# EasyEDA Pro project LEAP_CAM.epro

# Schematic LEAP_CAM

## Sheets
1 MAIN: Create Date: 2023-11-26; Page Name: MAIN; Project Name: AiPi-Cam-D200; Schematic Name: _AiPi-Cam-D200; Update Date: 2023-11-26; Company: 嘉立创EDA; Page Size: A4; Version: V1.0
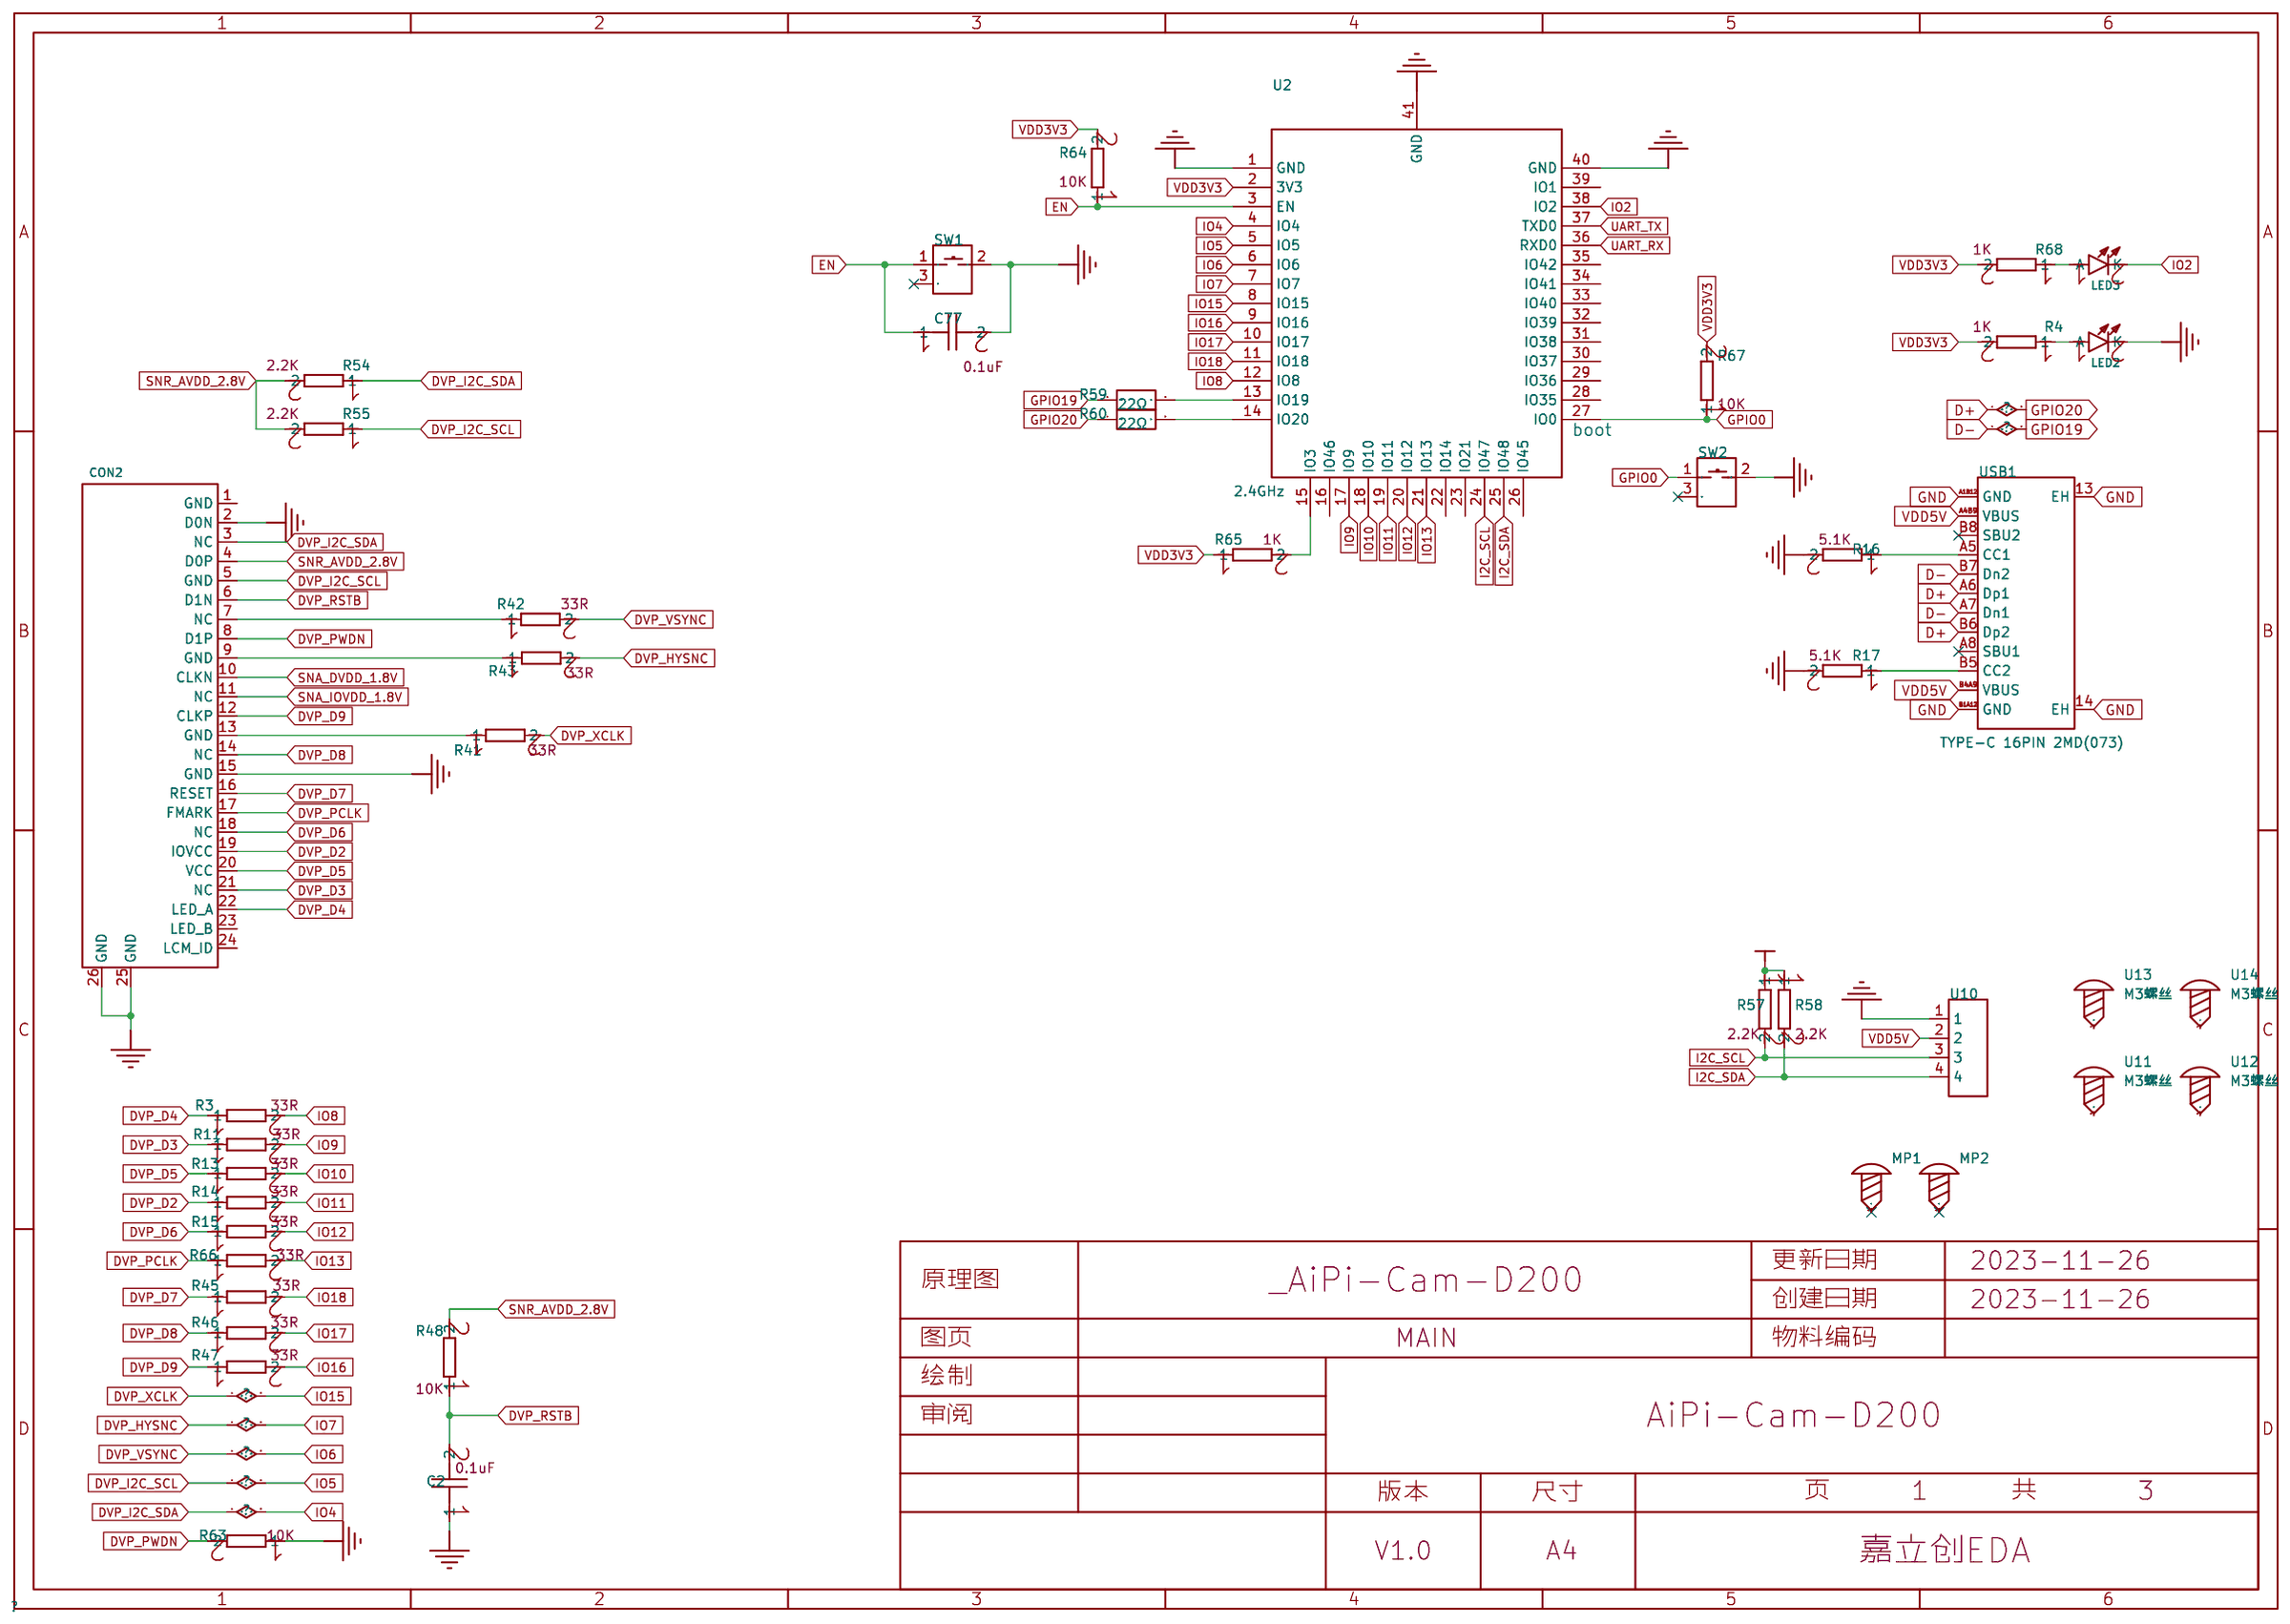
[diagram p0: MAIN]
2 POWER: Page Name: POWER
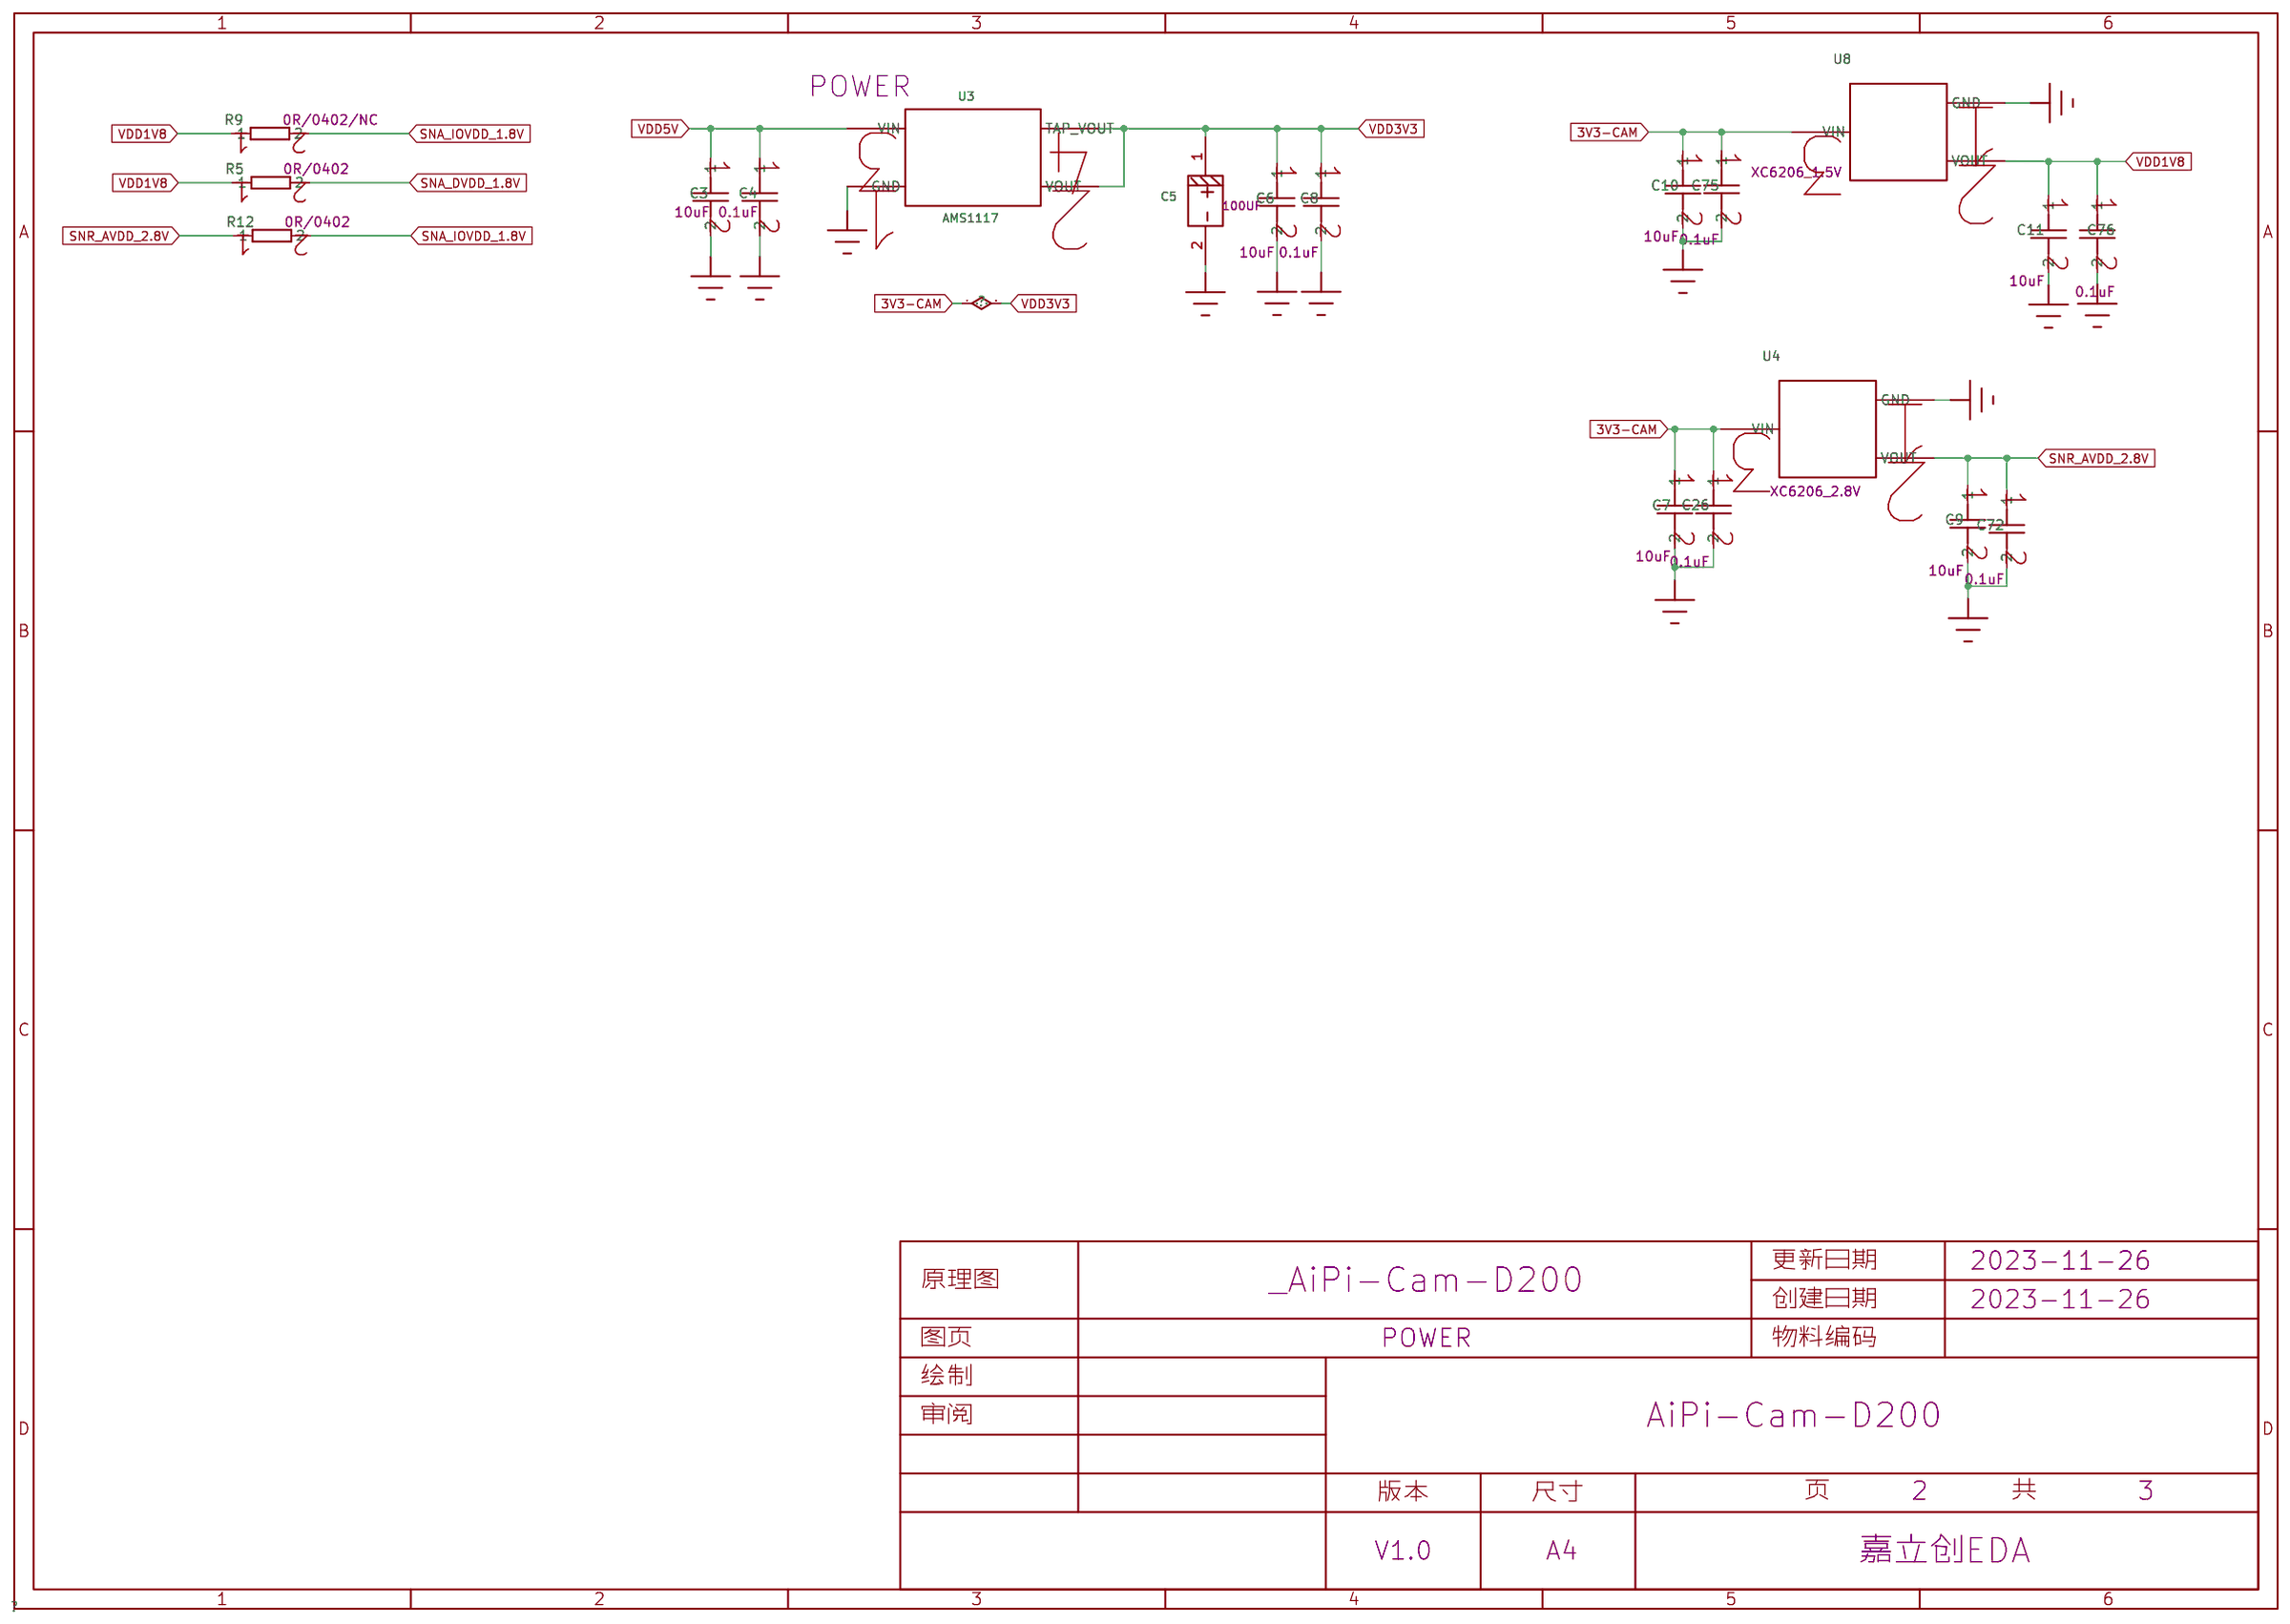
[diagram p1: POWER]
3 TF-CARD: Page Name: TF-CARD; Update Date: 2023-11-27
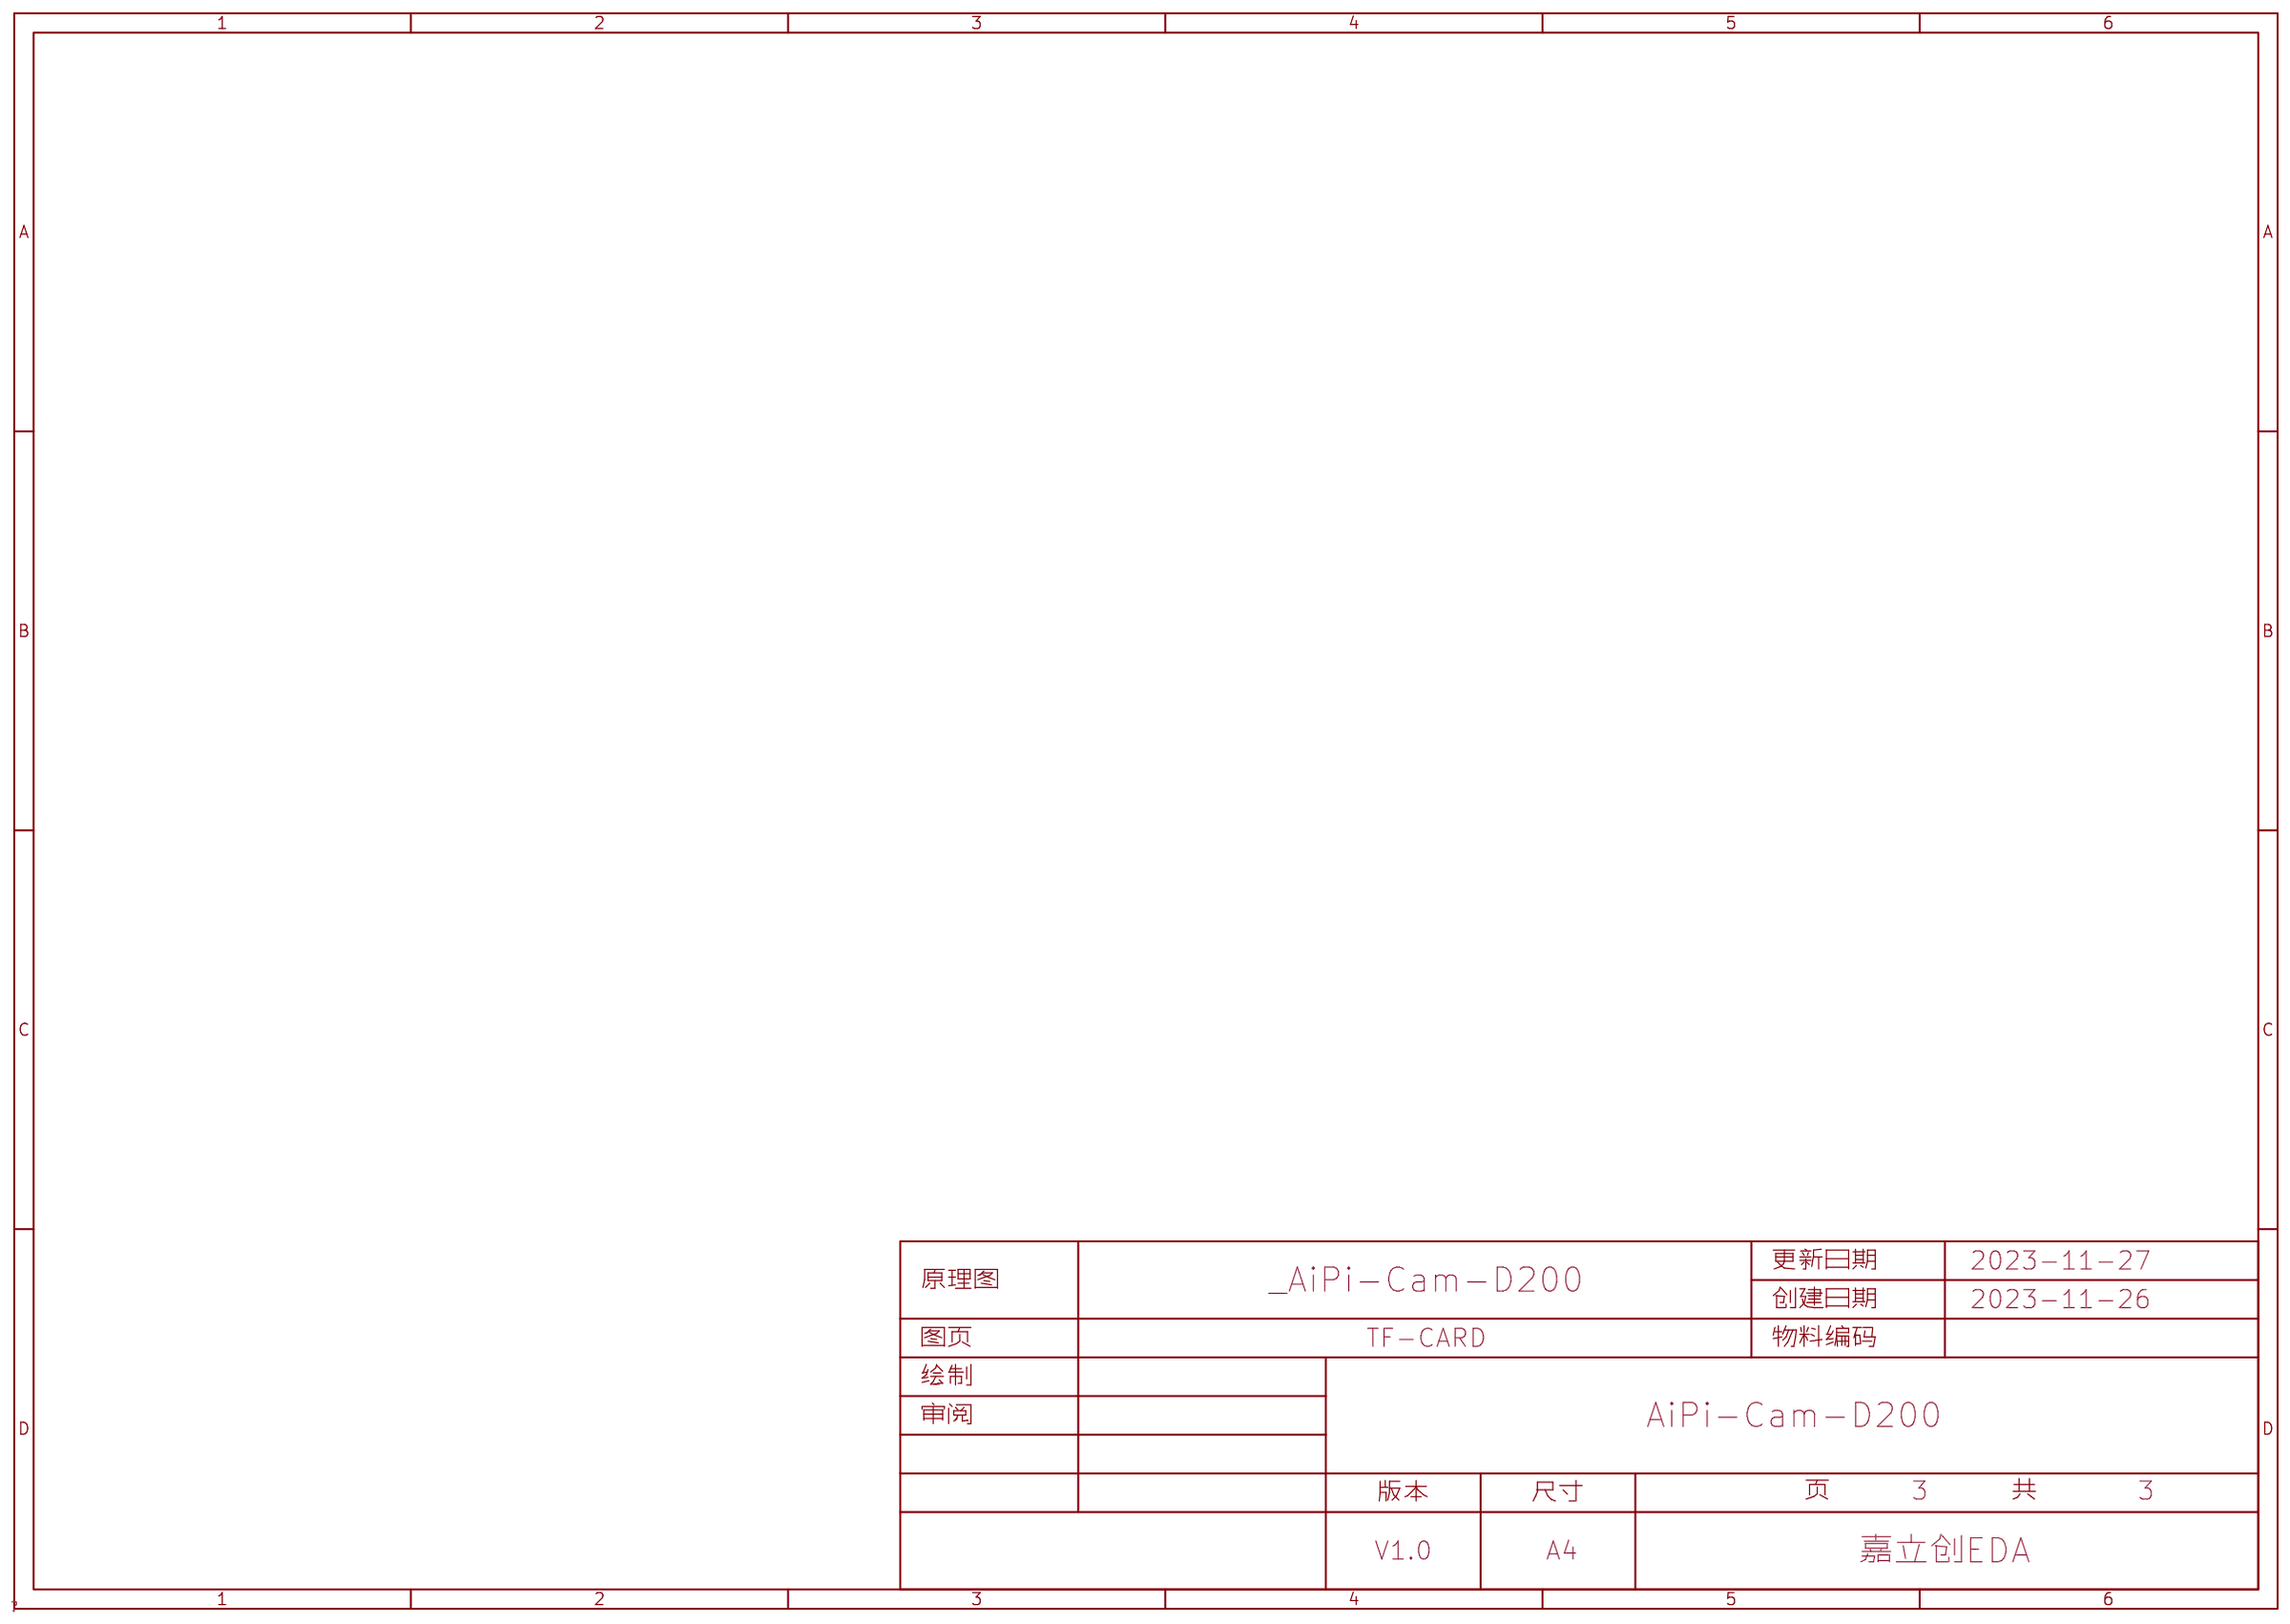
[diagram p2: TF-CARD]

## Parts
sheet MAIN
C2  CAP_NP  [C0402]
C77  CAP_NP  [C0402]
CON2  ST7701S  [FPC24PIN-0.5-PCB]
LED2  LED-SMD  [SMT_LED_0603]
LED3  LED-SMD  [SMT_LED_0603]
MP1  M2螺丝  [M2螺丝]
MP2  M2螺丝  [M2螺丝]
R3  33R  [R0402]
R4  1K  [R0402]
R11  33R  [R0402]
R13  33R  [R0402]
R14  33R  [R0402]
R15  33R  [R0402]
R16  5.1K  [R0402]
R17  5.1K  [R0402]
R41  R0402  [R0402]
R42  R0402  [R0402]
R43  R0402  [R0402]
R45  33R  [R0402]
R46  33R  [R0402]
R47  33R  [R0402]
R48  R0402  [R0402]
R54  2.2K  [R0402]
R55  2.2K  [R0402]
R57  2.2K  [R0402]
R58  2.2K  [R0402]
R59  22Ω  [R0402]
R60  22Ω  [R0402]
R63  10K  [R0402]
R64  R0402  [R0402]
R65  1K  [R0402]
R66  33R  [R0402]
R67  R0402  [R0402]
R68  1K  [R0402]
SW1  K2-1109DE-G4SW-04  [KEY-TH_3P-L4.5-W6.5-P3.00]
SW2  K2-1109DE-G4SW-04  [KEY-TH_3P-L4.5-W6.5-P3.00]
U2  2.4GHz  [WIRELM-SMD_ESP32-S3-WROOM-1U]
U10  WAFER-PH2.0-4PWZ  [CONN-TH_4P-P2.00_BX-PH2.0-4PWZ]
U11  M3螺丝  [M3螺丝孔]
U12  M3螺丝  [M3螺丝孔]
U13  M3螺丝  [M3螺丝孔]
U14  M3螺丝  [M3螺丝孔]
USB1  TYPE-C 16PIN 2MD(073)  [USB-C-SMD_TYPE-C-16PIN-2MD-073]
sheet POWER
C3  CAP_NP  [C0603]
C4  CAP_NP  [C0402]
C5  CAP-DAN-PART  [CAP-DAN-B3528-PCB]
C6  CAP_NP  [C0402]
C7  CAP_NP  [C0402]
C8  CAP_NP  [C0402]
C9  CAP_NP  [C0402]
C10  CAP_NP  [C0402]
C11  CAP_NP  [C0402]
C26  CAP_NP  [C0402]
C72  CAP_NP  [C0402]
C75  CAP_NP  [C0402]
C76  CAP_NP  [C0402]
R5  R0402  [R0402]
R9  R0402  [R0402]
R12  R0402  [R0402]
U3  AMS1117  [SOT-223]
U4  AF6206N_SOT23_PART  [SOT23-PCB]
U8  AF6206N_SOT23_PART  [SOT23-PCB]

## Library data of the parts
C2 C4 C8 C26 C72 C75 C77 = CAP_NP: Surface mount capacitor 0805; Comment: 0.1uF
CON2 = ST7701S
LED2 LED3 = LED-SMD: --ƬLED; BOMNRXQ: --ƬLED; BLZUHUEY: www.ooocke.com; UWSMDZUK: Դ----; Comment: W
MP1 MP2 = 螺丝孔
R3 R4 R11 R13-R17 R45-R47 R54 R55 R57 R58 R63 R65 R66 R68 = R0402: Surface mount resistor 0402
R41-R43 = R0402: Surface mount resistor 0402; Comment: 33R
R48 R64 R67 = R0402: Surface mount resistor 0402; Comment: 10K
R59 R60 = FRC0402F22R0TS: 电阻类型:厚膜电阻;阻值:22Ω;精度:±1%;功率:62.5mW;工作电压:50V;温度系数:±100ppm/℃;; LCSC Part Name: 22Ω ±1% 62.5mW 厚膜电阻; Supplier Part: C2929994; Manufacturer: FOJAN(富捷); Supplier Footprint: 0402; JLCPCB Part Class: Extended Part; Datasheet: https://item.szlcsc.com/datasheet/FRC0402F22R0TS/3266927.html; Supplier: LCSC; Type: 厚膜电阻; Tolerance: ±1%; Power(Watts): 62.5mW; Voltage-Supply(Max): 50V; Temperature Coefficient: ±100ppm/℃; Operating Temperature: -55℃~+155℃
SW1 SW2 = K2-1109DE-G4SW-04: 作用力:250gf;安装方式:卧插;开关长度:4.5mm;开关宽度:4.5mm;开关高度:6.5mm;触点电流:50mA;额定电压(DC):12V;绝缘电阻:100MΩ;机械寿命:10万次;; LCSC Part Name: 4.5*4.5*6.5 三脚侧插开关; Supplier Part: C2686326; Manufacturer: 韩国韩荣; Supplier Footprint: 插件; JLCPCB Part Class: Extended Part; Datasheet: https://atta.szlcsc.com/upload/public/pdf/source/20210810/329661682BA8B3C2B40574DEC7B97564.pdf; Supplier: LCSC; Operating Force: 250gf; Mounting Style: 卧插; Switch Length: 4.5mm; Switch Width: 4.5mm; Switch Height: 6.5mm; Contact Current: 50mA; Voltage Rating (DC): 12V; Insulation Resistance: 100MΩ; Mechanical Life: 10万次; Operating Temperature: -25℃~+85℃
U2 = ESP32-S3-WROOM-1U-N4: 核心芯片:ESP32-S3;频率:2.4GHz;发射功率:20.5dBm;接收灵敏度:-103.5dBm;; LCSC Part Name: 不带固件 通用型Wi-Fi+低功耗蓝牙MCU模组; Supplier Part: C2980296; Manufacturer: ESPRESSIF(乐鑫); Supplier Footprint: SMD,19.2x18mm; JLCPCB Part Class: Extended Part; Datasheet: https://item.szlcsc.com/datasheet/ESP32-S3-WROOM-1U-N4/3401548.html; Supplier: LCSC; Utilized IC / Part: ESP32-S3; Wireless Standard: Bluetooth5.0; Interface Type: I2C；UART；SPI；USB；I2S; Output Power: 20.5dBm; Voltage - Supply: 3V~3.6V; Receive  Current: 95mA; Send  Current: 355mA; Sensitivity: -103.5dBm; Operating Temperature: -40℃~+85℃
U10 = WAFER-PH2.0-4PWZ: 插针结构:1x4P;间距:2mm;安装方式:弯插;参考系列:PH;总PIN数:4P;排数:1;每排PIN数:4;行距:-;额定电流:2A;触头材质:黄铜;触头镀层:锡;工作温度:-25℃~+85℃;; LCSC Part Name: 1x4P 间距:2mm 弯插 系列:PH; Supplier Part: C5359612; Manufacturer: XUNPU(讯普); Supplier Footprint: 弯插,P=2mm; JLCPCB Part Class: Extended Part; Datasheet: https://item.szlcsc.com/datasheet/WAFER-PH2.0-4PWZ/6173848.html; Supplier: LCSC; Pins Structure: 1x4P; Pitch: 2mm; Mounting Type: 弯插; Reference Series: PH; Number of Pins: 4P; Number of Rows: 1; Number of PINs Per Row: 4; Current Rating: 2A; Contact Material: 黄铜; Contact Plating: 锡; Operating Temperature: -25℃~+85℃; Voltage Rating: 250V; Plastic Material: PA66; Flame Retardant Rating: UL94V-0; Color: 白色; Z-Height of the Board: 4.7mm; X-Length of Bottom Edge on Board (Spacing Line): 10mm; Y-Width of Bottom Edge on Board: 6.05mm
U11-U14 = M3螺丝
USB1 = TYPE-C 16PIN 2MD(073): 连接器类型:Type-C;协议标准:-;公母:母;安装方式:卧贴;触点数量:16P;端口数量:1;额定电流 - 电源:3A;工作温度:-25℃~+85℃;; LCSC Part Name: Type-C 母 卧贴; Supplier Part: C2765186; Manufacturer: SHOU HAN(首韩); Supplier Footprint: SMD; JLCPCB Part Class: Extended Part; Datasheet: https://item.szlcsc.com/datasheet/TYPE-C%252016PIN%25202MD(073)/2901843.html; Supplier: LCSC; Connector Type: Type-C; Gender: 母; Mounting Type: 卧贴; Number of Contacts: 16P; Number of Ports: 1; Current Rating-Power: 3A; Voltage Rating: 5V; Connect-Disconnect Life: 1万次; Detection color: 黑色; Operating Temperature: -25℃~+85℃
C3 C6 C7 C9-C11 = CAP_NP: Surface mount capacitor 0805; Comment: 10uF
C5 = CAP-DAN-PART: Vaule: 100UF
C76 = CAP_NP: Surface mount capacitor 0402; Comment: 0.1uF
R5 R12 = R0402: Surface mount resistor 0402; Comment: 0R/0402
R9 = R0402: Surface mount resistor 0402; Comment: 0R/0402/NC
U3 = AMS1117_1: Source_Path: D:\WORK\WORK\PROJECT2020\--Ŀ-б-\02_BW15_RTL8720C\BW15------\-------\ԭ--ͼ\BW15-KIT_V1_0.DSN
U4 = AF6206N_SOT23_PART: Comment: XC6206_2.8V
U8 = AF6206N_SOT23_PART: Comment: XC6206_1.5V

## Nets
GND: C2.1 C3.2 C4.2 C5.2 C6.2 C7.2 C8.2 C9.2 C10.2 C11.2 C26.2 C72.2 C75.2 C76.2 C77.2 CON2.2(D0N) CON2.15(GND) CON2.25(GND) CON2.26(GND) LED2.2(K) R16.2 R17.2 R63.1 SW1.2 SW2.2 U2.1(GND) U2.40(GND) U2.41(GND) U3.1(GND) U4.1(GND) U8.1(GND) U10.1 USB1.13(EH) USB1.14(EH) USB1.A1B12(GND) USB1.B1A12(GND)
VDD1V8: C11.1 C76.1 R5.1 R9.1 U8.2(VOUT)
VDD3V3: C5.1 C6.1 C7.1 C8.1 C10.1 C26.1 C75.1 R4.2 R57.1 R58.1 R64.2 R65.1 R67.2 R68.2 U2.2(3V3) U3.2(VOUT) U3.4(TAP_VOUT) U4.3(VIN) U8.3(VIN)
VDD5V: C3.1 C4.1 U3.3(VIN) U10.2 USB1.A4B9(VBUS) USB1.B4A9(VBUS)
___476: CON2.13(GND) R41.1
___2379: CON2.9(GND) R43.1
___2451: CON2.7(NC) R42.1
___6269: LED2.1(A) LED3.1(A) R4.1 R68.1
D+: R60.1 USB1.A6(Dp1) USB1.B6(Dp2)
D-: R59.1 USB1.A7(Dn1) USB1.B7(Dn2)
DVP_D2: CON2.19(IOVCC) R14.1
DVP_D3: CON2.21(NC) R11.1
DVP_D4: CON2.22(LED_A) R3.1
DVP_D5: CON2.20(VCC) R13.1
DVP_D6: CON2.18(NC) R15.1
DVP_D7: CON2.16(RESET) R45.1
DVP_D8: CON2.14(NC) R46.1
DVP_D9: CON2.12(CLKP) R47.1
DVP_HYSNC: R43.2 U2.7(IO7)
DVP_I2C_SCL: CON2.5(GND) R55.1 U2.5(IO5)
DVP_I2C_SDA: CON2.3(NC) R54.1 U2.4(IO4)
DVP_PCLK: CON2.17(FMARK) R66.1
DVP_PWDN: CON2.8(D1P) R63.2
DVP_RSTB: C2.2 CON2.6(D1N) R48.1
DVP_VSYNC: R42.2 U2.6(IO6)
DVP_XCLK: R41.2 U2.8(IO15)
EN: C77.1 R64.1 SW1.1 U2.3(EN)
GPIO0: R67.1 SW2.1 U2.27(IO0)
I2C_SCL: R57.2 U2.24(IO47) U10.3
I2C_SDA: R58.2 U2.25(IO48) U10.4
IO2: LED3.2(K) U2.38(IO2)
IO8: R3.2 U2.12(IO8)
IO9: R11.2 U2.17(IO9)
IO10: R13.2 U2.18(IO10)
IO11: R14.2 U2.19(IO11)
IO12: R15.2 U2.20(IO12)
IO13: R66.2 U2.21(IO13)
IO16: R47.2 U2.9(IO16)
IO17: R46.2 U2.10(IO17)
IO18: R45.2 U2.11(IO18)
SNA_DVDD_1.8V: CON2.10(CLKN) R5.2
SNA_IOVDD_1.8V: CON2.11(NC) R9.2 R12.2
SNR_AVDD_2.8V: C9.1 C72.1 CON2.4(D0P) R12.1 R48.2 R54.2 R55.2 U4.2(VOUT)
UART_RX: U2.36(RXD0)
UART_TX: U2.37(TXD0)
$1N2819: R16.1 USB1.A5(CC1)
$1N2820: R17.1 USB1.B5(CC2)
$1N2861: R59.2 U2.13(IO19)
$1N2863: R60.2 U2.14(IO20)
$1N2883: R65.2 U2.15(IO3)

Not connected (* = marked no-connect by the designer): CON2 1(GND) 23(LED_B) 24(LCM_ID); MP1 1*; MP2 1*; SW1 3*; SW2 3*; U2 16(IO46) 22(IO14) 23(IO21) 26(IO45) 28(IO35) 29(IO36) 30(IO37) 31(IO38) 32(IO39) 33(IO40) 34(IO41) 35(IO42) 39(IO1); U11 1; U12 1; U13 1; U14 1; USB1 A8(SBU1)* B8(SBU2)*

## Notes on the sheets
sheet 1
- boot
sheet 2
- POWER

# Board AiPi-Cam-D200
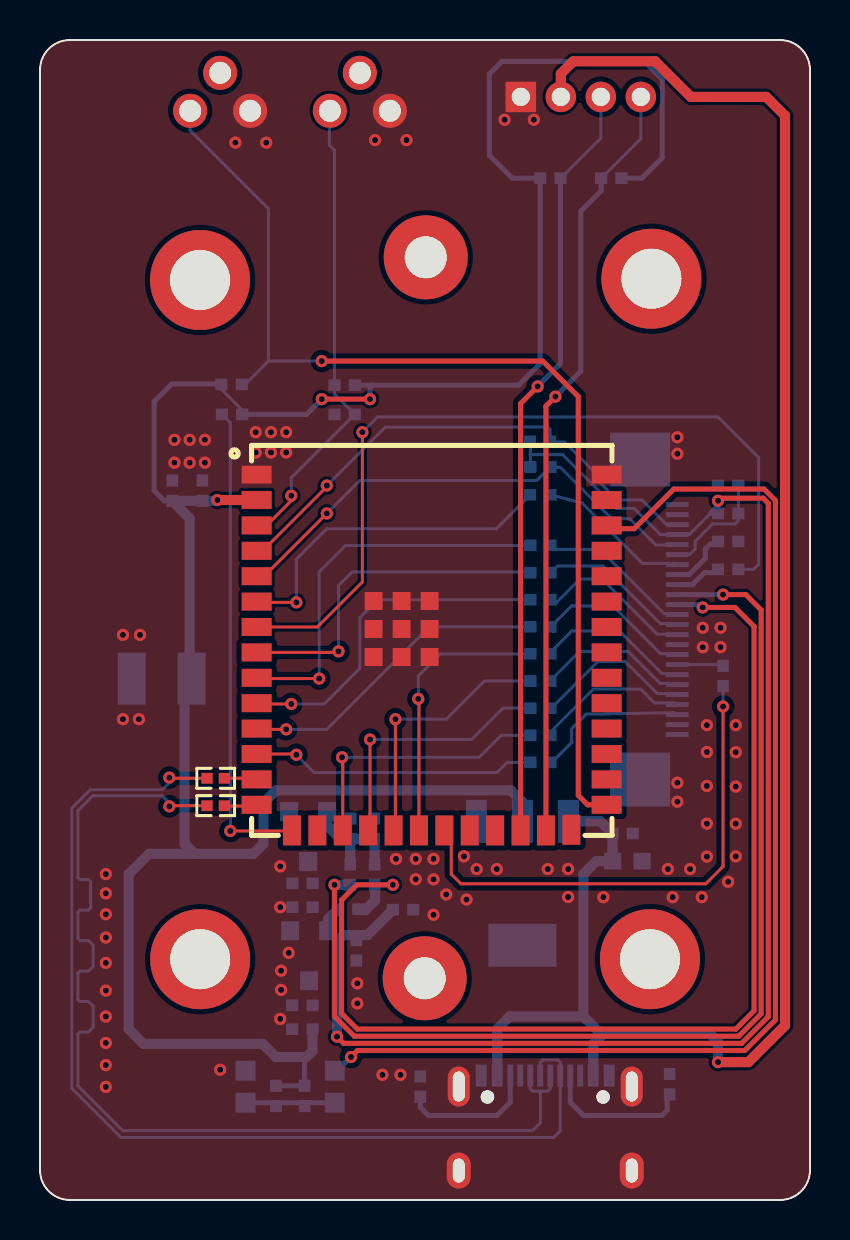
[diagram p3: board, top side]
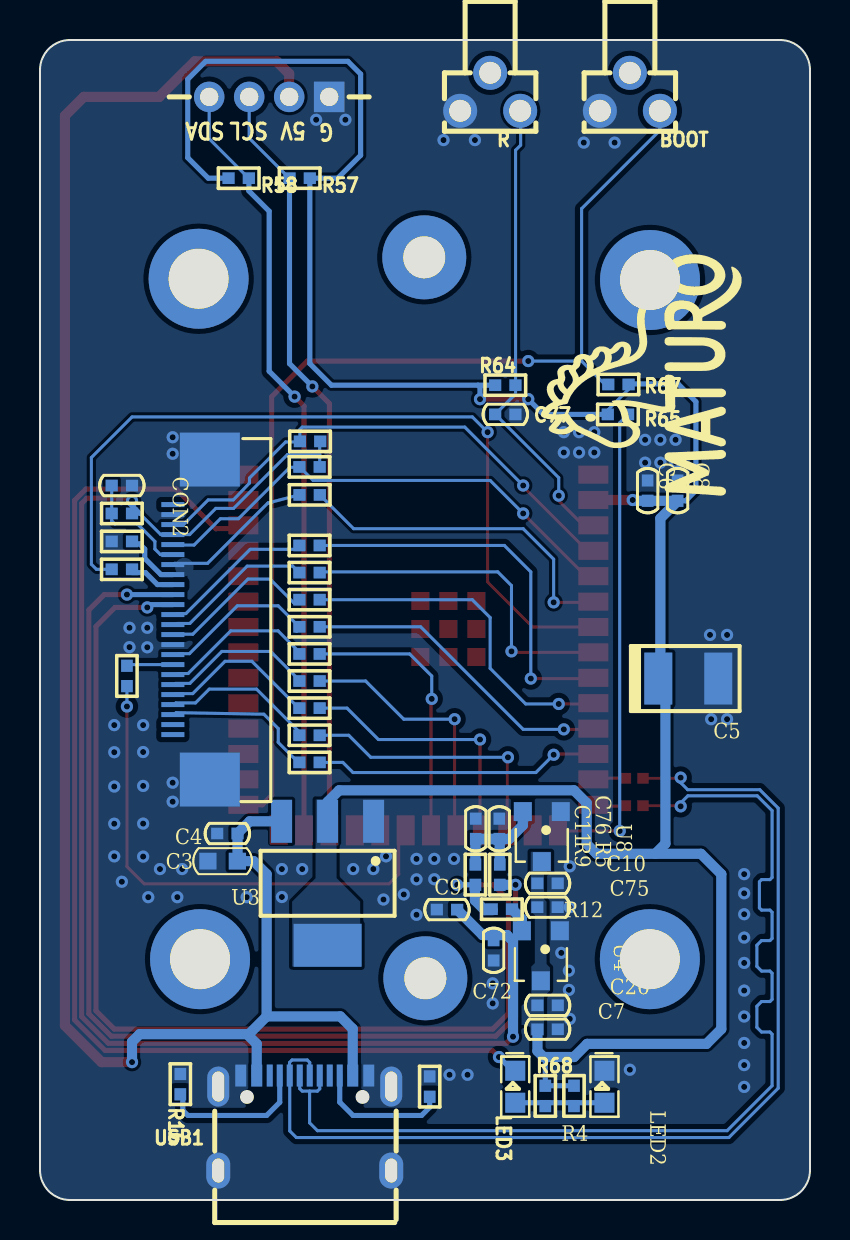
[diagram p4: board, bottom side, seen from below]

Outline 38.5 x 58 mm; copper layers: Top Layer, Bottom Layer. Coordinates in mm from the lower left corner of the outline.
Outline path: 0,56.5 arc(0.44,57.56) 1.5,58 37,58 arc(38.06,57.56) 38.5,56.5 38.5,1.5 arc(38.06,0.44) 37,0 1.5,0 arc(0.44,0.44) 0,1.5 0,56.5
Stack: Top Layer 0.035mm / Dielectric1 1.51mm FR4 er 4.5 / Bottom Layer 0.035mm

## Design rules (mm)
net UART_TX: DP2
net UART_RX: DP2
net D-: DP1
net D+: DP1
spacing safeClearance (default): track to track 0.102, other pairs 0.152 to 0.3
spacing Plane_innerPlane: track to track 0.152, other pairs 0 to 0.381
spacing Copper_POR11904344: track to track 0.152, other pairs 0 to 0.381
spacing Copper_POR18922552: track to track 0.152, other pairs 0 to 0.381
track width trackWidth (default): min 0.152, default 0.152, max 2.032
differential pair differentialPair (default): width min 0.127, default 0.254, max 2.54; gap min 0.152, default 0.152
net GND uses POR18922552
pour e807 uses Copper_POR18922552
pour e814 uses Copper_POR18922552

## Placement (name value [footprint] x y rotation side)
BOOT  K2-1109DE-G4SW-04  [KEY-TH_3P-L4.5-W6.5-P3.00]  9.01 55.41 0 bottom
C2  CAP_NP  [C0402]  34.41 35.72 0 bottom
C3  CAP_NP  [C0603]  29.37 16.94 0 bottom
C4  CAP_NP  [C0402]  29.13 18.33 0 bottom
C5  CAP-DAN-PART  [CAP-DAN-B3528-PCB]  6.09 26.07 180 bottom
C6  CAP_NP  [C0402]  8.12 35.47 90 bottom
C7  CAP_NP  [C0402]  13.12 8.54 180 bottom
C8  CAP_NP  [C0402]  6.62 35.47 90 bottom
C9  CAP_NP  [C0402]  18.15 14.52 0 bottom
C10  CAP_NP  [C0402]  13.12 15.84 180 bottom
C11  CAP_NP  [C0402]  16.71 18.56 90 bottom
C26  CAP_NP  [C0402]  13.12 9.73 180 bottom
C72  CAP_NP  [C0402]  15.82 12.48 270 bottom
C75  CAP_NP  [C0402]  13.12 14.64 180 bottom
C76  CAP_NP  [C0402]  15.54 18.56 90 bottom
C77  CAP_NP  [C0402]  15.23 39.28 180 bottom
CON2  ST7701S  [FPC24PIN-0.5-PCB]  31.86 29.02 270 bottom
LED2  LED-SMD  [SMT_LED_0603]  10.28 5.66 90 bottom
LED3  LED-SMD  [SMT_LED_0603]  14.74 5.66 90 bottom
MP1  -  [M2螺丝]  19.29 47.13 0 top
MP2  -  [M2螺丝]  19.23 11.09 0 top
R  K2-1109DE-G4SW-04  [KEY-TH_3P-L4.5-W6.5-P3.00]  15.99 55.41 0 bottom
R3  33R  [R0402#2]  25.02 21.88 180 bottom
R4  1K  [R0402#2]  11.8 5.2 90 bottom
R5  R0402  [R0402#2]  15.51 16.27 270 bottom
R9  R0402  [R0402#2]  16.73 16.27 270 bottom
R11  33R  [R0402#2]  25.02 23.24 180 bottom
R12  R0402  [R0402#2]  15.41 14.54 0 bottom
R13  33R  [R0402#2]  25.02 24.59 180 bottom
R14  33R  [R0402#2]  25.02 25.95 180 bottom
R15  33R  [R0402#2]  25.02 27.3 180 bottom
R16  5.1K  [R0402#2]  31.48 5.79 90 bottom
R17  5.1K  [R0402#2]  19.02 5.67 90 bottom
R41  R0402  [R0402#2]  25.02 31.37 180 bottom
R42  R0402  [R0402#2]  25.02 35.26 180 bottom
R43  R0402  [R0402#2]  34.41 31.53 0 bottom
R45  33R  [R0402#2]  25.02 28.66 180 bottom
R46  33R  [R0402#2]  25.02 30.02 180 bottom
R47  33R  [R0402#2]  25.02 32.73 180 bottom
R48  R0402  [R0402#2]  34.41 34.33 180 bottom
R54  2.2K  [R0402#2]  25 37.93 180 bottom
R55  2.2K  [R0402#2]  25.02 36.65 180 bottom
R57  2.2K  [R0402#2]  25.52 51.09 0 bottom
R58  2.2K  [R0402#2]  28.56 51.09 180 bottom
R59  22Ω  [R0402]  8.79 21.09 0 top
R60  22Ω  [R0402]  8.79 19.72 0 top
R63  10K  [R0402#2]  34.41 32.93 180 bottom
R64  R0402  [R0402#2]  15.23 40.74 0 bottom
R65  1K  [R0402#2]  9.6 39.28 180 bottom
R66  33R  [R0402#2]  34.15 26.2 270 bottom
R67  R0402  [R0402#2]  9.58 40.78 180 bottom
R68  1K  [R0402#2]  13.23 5.2 90 bottom
U2  2.4GHz  [WIRELM-SMD_ESP32-S3-WROOM-1U]  19.58 27.38 0 top
U3  AMS1117  [SOT-223]  24.12 14.18 90 bottom
U4  AF6206N_SOT23_PART  [SOT23-PCB]  13.44 12.38 0 bottom
U8  AF6206N_SOT23_PART  [SOT23-PCB]  13.39 18.34 0 bottom
U10  WAFER-PH2.0-4PWZ  [CONN-TH_4P-P2.00_BX-PH2.0-4PWZ]  27.04 55.16 0 bottom
U11  M3螺丝  [M3螺丝孔]  30.44 46.19 0 top
U12  M3螺丝  [M3螺丝孔]  7.88 12.17 0 top
U13  M3螺丝  [M3螺丝孔]  30.37 12.17 0 top
U14  M3螺丝  [M3螺丝孔]  7.87 46.13 0 top
USB1  TYPE-C 16PIN 2MD(073)  [USB-C-SMD_TYPE-C-16PIN-2MD-073]  25.26 3.85 180 bottom

## Footprints (pads in the part's own frame, mm; a bottom-side part is the same pattern mirrored in y, then rotated)
C0402
  rect 0.61x0.584 smd: 1(-0.508,0) 2(0.508,0)
C0603
  rect 0.864x0.838 smd: 1(-0.737,0) 2(0.737,0)
CAP-DAN-B3528-PCB
  rect 1.4x2.6 smd: 1(-1.498,0) 2(1.498,0)
CONN-TH_4P-P2.00_BX-PH2.0-4PWZ
  rect 1.524x1.524 hole 0.914: 1(-3,0)
  round 1.524 hole 0.914: 2(-1,0) 3(1,0) 4(3,0)
FPC24PIN-0.5-PCB
  rect 0.25x1.15 smd: 1(-5.75,0) 2(-5.25,0) 3(-4.75,0) 4(-4.25,0) 5(-3.75,0) 6(-3.25,0) 7(-2.75,0) 8(-2.25,0) 9(-1.75,0) 10(-1.25,0) 11(-0.75,0) 12(-0.25,0) 13(0.25,0) 14(0.75,0) 15(1.25,0) 16(1.75,0) 17(2.25,0) 18(2.75,0) 19(3.25,0) 20(3.75,0) 21(4.25,0) 22(4.75,0) 23(5.25,0) 24(5.75,0)
  rect 2.7x3 smd: 25(8,1.85) 26(-8,1.85)
KEY-TH_3P-L4.5-W6.5-P3.00
  round 1.7 hole 1.1: 1(-1.5,0.95) 2(1.5,0.95) 3(0,-0.95)
M2螺丝
  round 4.2 hole 2.1: 1(0,0)
M3螺丝孔
  round 5 hole 3: 1(0.127,-0.127)
R0402
  rect 0.566x0.54 smd: 1(-0.433,0) 2(0.433,0)
R0402#2
  rect 0.61x0.584 smd: 1(-0.508,0) 2(0.508,0)
SMT_LED_0603
  rect 1x1 smd: 1(-0.8,0) 2(0.8,0)
SOT23-PCB
  rect 0.9x0.95 smd: 1(-0.934,-1.083) 2(0.966,-1.083) 3(0.015,1.417)
SOT-223
  rect 2.15x1.05 smd: 1(4.751,-2.3) 2(4.751,0) 3(4.751,2.3)
  rect 2.15x3.4 smd: 4(-1.449,0)
USB-C-SMD_TYPE-C-16PIN-2MD-073
  oval 1.2x1.8 hole 0.6x1.2: 13(-4.325,-2.375) 14(4.325,-2.375)
  oval 1.1x2 hole 0.6x1.5: 13(-4.325,1.825) 14(4.325,1.825)
  rect 0.55x1.1 smd: A1B12(-3.2,2.375) A4B9(-2.4,2.375) B1A12(3.2,2.375) B4A9(2.4,2.375)
  rect 0.3x1.1 smd: A5(-1.25,2.375) A6(-0.25,2.375) A7(0.25,2.375) A8(1.25,2.375) B5(1.75,2.375) B6(0.75,2.375) B7(-0.75,2.375) B8(-1.75,2.375)
WIRELM-SMD_ESP32-S3-WROOM-1U
  rect 1.5x0.9 smd: 1(-8.75,8.895) 2(-8.75,7.625) 3(-8.75,6.355) 4(-8.75,5.085) 5(-8.75,3.815) 6(-8.75,2.545) 7(-8.75,1.275) 8(-8.75,0.005) 9(-8.75,-1.265) 10(-8.75,-2.535) 11(-8.75,-3.805) 12(-8.75,-5.075) 13(-8.75,-6.345) 14(-8.75,-7.615) 27(8.75,-7.615) 28(8.75,-6.345) 29(8.75,-5.075) 30(8.75,-3.805) 31(8.75,-2.535) 32(8.75,-1.265) 33(8.75,0.005) 34(8.75,1.275) 35(8.75,2.545) 36(8.75,3.815) 37(8.75,5.085) 38(8.75,6.355) 39(8.75,7.625) 40(8.75,8.895)
  rect 0.9x1.5 smd: 15(-6.985,-8.895) 16(-5.715,-8.895) 17(-4.445,-8.895) 18(-3.175,-8.895) 19(-1.905,-8.895) 20(-0.635,-8.895) 21(0.635,-8.895) 22(1.905,-8.895) 23(3.175,-8.895) 24(4.445,-8.895) 25(5.715,-8.895) 26(6.985,-8.865)
  rect 0.9x0.9 smd: 41(-2.9,2.575) 41(-2.9,1.175) 41(-2.9,-0.225) 41(-1.5,2.575) 41(-1.5,1.175) 41(-1.5,-0.225) 41(-0.1,2.575) 41(-0.1,1.175) 41(-0.1,-0.225)

## Nets
As in the schematic, except:
GND: BOOT.2 C2.1 C3.2 C4.2 C5.2 C6.2 C7.2 C8.2 C9.2 C10.2 C11.2 C26.2 C72.2 C75.2 C76.2 C77.2 CON2.2 CON2.15 CON2.25 CON2.26 LED2.2 R.2 R16.2 R17.2 R63.1 U2.1 U2.40 U2.41 U3.1 U4.1 U8.1 U10.1 USB1.13 USB1.14 USB1.A1B12 USB1.B1A12
EN: C77.1 R.1 R64.1 U2.3
GPIO0: BOOT.1 R67.1 U2.27

Pads without a net: BOOT 3; CON2 1 23 24; MP1 1; MP2 1; R 3; U2 16 22 23 26 28 29 30 31 32 33 34 35 39; U11 1; U12 1; U13 1; U14 1; USB1 A8 B8

## Via types
v1: diameter 0.61, hole 0.305, Top Layer to Bottom Layer, 113 vias

## Routing (per net, layer and track width the routed paths; a pad name or vN(x,y) marks a point on that pad's centre or on a via; arc(x,y) is an arc through that point)
GND:
  vias: v1(3.29,16.29) v1(3.29,15.33) v1(3.29,14.29) v1(3.29,13.12) v1(3.29,11.85) v1(3.29,10.47) v1(3.29,9.17) v1(3.29,7.85) v1(3.29,6.75) v1(3.29,5.66) v1(4.15,28.25) v1(4.15,24.04) v1(5,28.25) v1(4.94,24.04) v1(6.72,38.01) v1(6.72,36.87) v1(7.48,38.01) v1(7.48,36.87) v1(8.25,38.01) v1(8.25,36.87) v1(9.01,6.51) v1(9.77,52.87) v1(10.78,38.39) v1(10.78,37.38) v1(11.31,52.87) v1(11.55,38.39) v1(11.55,37.38) v1(12.01,16.68) v1(12.01,14.64) v1(12.01,9.06) v1(12.06,11.47) v1(12.06,10.51) v1(12.31,38.39) v1(12.31,37.38) v1(12.44,12.36) v1(15.87,10.83) v1(15.87,9.83) v1(16.75,53) v1(17.12,6.26) v1(17.8,17.06) v1(18.02,6.26) v1(18.32,53) v1(18.79,17.06) v1(18.79,16.04) v1(19.68,17.06) v1(19.68,16.03) v1(19.68,14.26) v1(20.31,15.28) v1(21.2,17.18) v1(21.33,15.02) v1(21.83,16.55) v1(22.84,16.55) v1(23.23,54.01) v1(24.69,54.01) v1(25.39,16.55) v1(26.41,16.55) v1(26.41,15.15) v1(28.17,15.14) v1(31.39,16.55) v1(31.63,15.14) v1(31.87,38.14) v1(31.87,37.31) v1(31.87,20.87) v1(31.87,19.92) v1(32.5,16.55) v1(33.14,28.61) v1(33.14,27.64) v1(33.09,15.14) v1(33.34,23.75) v1(33.34,22.4) v1(33.34,20.7) v1(33.34,18.82) v1(33.34,17.17) v1(34.03,28.61) v1(34.03,27.64) v1(34.41,15.91) v1(34.79,23.75) v1(34.79,22.39) v1(34.79,20.67) v1(34.79,18.81) v1(34.79,17.18)
VDD1V8: length 5.9
  Bottom Layer w0.508: 15.51,18.05 C76.1 C11.1 16.73,18.05 R9.1 ; 15.51,18.05 15.04,18.05 14.36,18.73 14.36,19.42 ; 15.51,18.05 R5.1
VDD3V3: length 128.9
  Top Layer w0.254: v1(14.09,40.04) v1(16.5,40.04)
  Top Layer w0.508: v1(8.87,35) 10.83,35
  Bottom Layer w0.152: R67.2 9.07,40.54 10.11,39.5 R65.1
  Bottom Layer w0.254: 16.59,40.74 23.93,40.74 25.01,41.82 25.01,51.09 23.61,51.09 22.47,52.23 22.47,56.3 23.1,56.93 30.22,56.93 31.11,56.04 31.11,52.12 30.09,51.09 R58.1 ; 16.59,40.74 16.5,40.65 v1(16.5,40.04) ; 16.59,40.74 R64.2 ; R67.2 9.04,40.8 6.59,40.8 5.71,39.92 5.71,35.47 6.22,34.96 C8.1 ; 13.33,7.15 13.23,7.06 R68.2 R4.2 ; R65.1 13.33,39.28 v1(14.09,40.04)
  Bottom Layer w0.508: v1(8.87,35) 8.83,34.96 C6.1 C8.1 6.62,34.94 7.48,34.08 7.48,26.43 7.61,26.3 ; 7.74,17.31 10.67,17.31 11.17,17.81 11.17,19.85 11.8,20.48 23.54,20.48 24.12,19.91 U3.2 ; 7.74,17.31 7.23,17.82 7.23,25.92 7.61,26.3 ; 7.74,17.31 5.45,17.31 4.44,16.29 4.44,8.55 5.18,7.81 11.14,7.81 11.8,7.15 13.33,7.15 13.63,7.45 C7.1 ; 7.61,26.3 7.84,26.07
VDD5V: length 93.5
  Top Layer w0.508: v1(33.9,6.89) 35.42,6.89 37.25,8.73 37.25,54.21 36.31,55.16 32.54,55.16 30.76,56.93 26.66,56.93 26.04,56.31 U10.2
  Bottom Layer w0.508: 28.15,8.29 28.06,8.29 27.17,9.18 ; 28.15,8.29 27.66,7.81 USB1.A4B9 ; 28.15,8.29 33.52,8.29 33.9,7.91 v1(33.9,6.89) ; 27.17,9.18 23.49,9.18 22.86,8.56 USB1.B4A9 ; 27.17,9.18 27.17,16.29 27.82,16.94 C3.1 28.62,16.95 C4.1 28.01,18.94 U3.3
___476: length 7.6
  Bottom Layer w0.152: 31.66,28.83 31.01,28.83 28.14,31.69 25.87,31.69 25.42,31.24
___2379: length 2.3
  Bottom Layer w0.254: 33.9,31.37 33.23,31.37 32.63,30.77 CON2.9
___2451: length 7.5
  Bottom Layer w0.152: 31.79,31.8 31.77,31.83 30.12,31.83 27.11,34.85 27.09,34.85 25.56,35.25
___6269: length 4.5
  Bottom Layer w0.254: LED3.1 LED2.1
D+: length 52.3
  Top Layer w0.152: 8.35,19.72 6.5,19.72 v1(6.47,19.68)
  Bottom Layer w0.152: 25.02,5.44 25.02,3.86 24.63,3.47 4.14,3.47 1.9,5.71 1.9,8.29 2,8.4 2.42,8.4 2.66,8.63 2.66,9.69 2.42,9.92 2,9.92 1.9,10.03 1.9,11.34 2,11.45 2.42,11.45 2.66,11.68 2.66,12.74 2.42,12.97 2,12.97 1.9,13.08 1.9,14.39 2,14.5 2.42,14.5 2.53,14.6 2.53,15.91 2.42,16.02 2,16.02 1.9,16.13 1.9,19.47 2.64,20.21 6.11,20.21 6.47,19.85 v1(6.47,19.68) ; 25.02,5.44 24.63,5.44 24.51,5.56 USB1.B6 ; 25.02,5.44 25.39,5.44 25.51,5.57 USB1.A6
D-: length 52.3
  Top Layer w0.152: 8.35,21.09 6.5,21.09 v1(6.47,21.12)
  Bottom Layer w0.152: v1(6.47,21.12) 6.47,20.87 6.12,20.52 2.51,20.52 1.59,19.59 1.59,5.59 4.05,3.12 25.68,3.12 26.01,3.45 USB1.B7 26.03,6.23 26.03,6.87 25.9,7 25.14,7 25.01,6.88 USB1.A7
DVP_D2: length 7.6
  Bottom Layer w0.152: 31.73,25.83 31,25.83 29.41,27.43 26.97,27.43 25.54,26 25.54,25.81
DVP_D3: length 7.6
  Bottom Layer w0.152: 31.73,24.83 31.71,24.85 30.73,24.85 30.04,25.54 27.67,25.54 25.54,23.41 25.54,23.16
DVP_D4: length 7.6
  Bottom Layer w0.152: 31.73,24.33 31.69,24.37 27.31,24.29 26.59,23.57 26.59,22.9 ; 25.54,21.83 26.6,22.89
DVP_D5: length 7.6
  Bottom Layer w0.152: 31.73,25.32 30.87,25.32 29.25,26.93 27.9,26.93 25.69,24.72
DVP_D6: length 7.6
  Bottom Layer w0.152: 31.62,26.32 31.1,26.32 28.96,28.46 26.6,28.46 25.53,27.39 25.53,27.17
DVP_D7: length 7.6
  Bottom Layer w0.152: 25.67,28.43 25.67,28.79 26.59,29.71 28.63,29.71 31.03,27.32 31.54,27.32 31.55,27.3
DVP_D8: length 7.6
  Bottom Layer w0.152: 25.59,29.86 25.81,29.86 27,31.05 28.1,31.05 30.86,28.29 31.59,28.29
DVP_D9: length 7.6
  Bottom Layer w0.152: 25.38,32.53 27.99,32.53 31.21,29.32 31.68,29.32
DVP_HYSNC: length 41.1
  Top Layer w0.152: v1(16.12,38.39) 16.12,30.9 13.87,28.65 U2.7
  Bottom Layer w0.152: R43.2 35.68,31.53 35.93,31.79 35.93,37.12 33.9,39.15 16.88,39.15 v1(16.12,38.39)
DVP_I2C_SCL: length 24.5
  Top Layer w0.152: U2.5 11.2,31.19 v1(14.34,34.33)
  Bottom Layer w0.152: 31.49,32.75 30.8,32.75 29.48,34.06 28.58,34.06 26.01,36.63 R55.1 25.52,36.65 24.84,35.98 15.99,35.98 v1(14.34,34.33)
DVP_I2C_SDA: length 26
  Top Layer w0.152: v1(14.34,35.72) 14.34,35.67 11.13,32.46 10.83,32.46
  Bottom Layer w0.152: 31.67,33.74 31.65,33.76 31.33,33.76 30.09,35 28.83,35 28.03,35.85 28.03,36.1 26.22,37.9 25.54,37.9 R54.1 25.51,38.53 25.39,38.65 17.26,38.65 v1(14.34,35.72)
DVP_PCLK: length 2.3
  Bottom Layer w0.152: CON2.17 34.09,26.77 R66.1
DVP_PWDN: length 2.9
  Bottom Layer w0.254: 33.9,32.8 33.52,32.8 33.26,32.55 33.26,32.08 32.45,31.27 CON2.8
DVP_RSTB: length 5.7
  Bottom Layer w0.152: CON2.6 32.48,32.27 32.76,32.55 32.76,32.93 33.63,33.81 34.76,33.81 34.92,33.96 R48.1 C2.2
DVP_VSYNC: length 17.2
  Top Layer w0.152: U2.6 10.87,29.88 v1(12.82,29.88)
  Bottom Layer w0.152: 24.51,35.26 22.82,33.57 14.34,33.57 12.82,32.04 v1(12.82,29.88)
DVP_XCLK: length 17.3
  Top Layer w0.152: v1(14.93,27.43) 14.87,27.38 10.83,27.38
  Bottom Layer w0.152: 24.5,31.23 24.32,31.41 15.61,31.41 14.93,30.72 v1(14.93,27.43)
EN: length 23.6
  Top Layer w0.152: U2.3 11.33,33.73 12.56,34.96 v1(12.56,35.22)
  Bottom Layer w0.152: v1(12.56,35.22) 12.56,36.11 15.73,39.28 C77.1 14.72,40.3 14.72,52.49 14.47,52.74 14.47,54.44 R.1
GPIO0: length 53.5
  Top Layer w0.254: v1(14.09,41.95) 25.14,41.95 26.91,40.17 26.91,20.23 27.38,19.76 U2.27
  Bottom Layer w0.152: 11.42,41.95 v1(14.09,41.95) ; 11.42,41.95 11.42,49.57 7.51,53.48 7.51,54.21 ; 11.42,41.95 10.25,40.78 R67.1
I2C_SCL: length 38.3
  Top Layer w0.254: U2.24 24.03,39.82 v1(24.88,40.68)
  Bottom Layer w0.152: U10.3 28.04,53.09 26.04,51.09 R57.2
  Bottom Layer w0.254: R57.2 26.03,41.82 v1(24.88,40.68)
I2C_SDA: length 38.6
  Top Layer w0.254: U2.25 25.3,39.7 v1(25.77,40.17)
  Bottom Layer w0.152: U10.4 30.04,53.06 28.07,51.09 28.06,51.09
  Bottom Layer w0.254: v1(25.77,40.17) 27.04,41.44 27.04,49.44 28.06,50.46 28.06,51.09
IO2: length 58.6
  Top Layer w0.254: v1(15.55,7.15) 15.88,7.48 35.24,7.48 36.77,9 36.77,34.98 36.21,35.55 31.69,35.55 29.71,33.57 28.5,33.57 U2.38
  Bottom Layer w0.254: v1(15.55,7.15) 14.87,6.46 LED3.2
IO8: length 14.3
  Top Layer w0.152: 10.83,22.3 12.73,22.3 12.77,22.26 v1(12.82,22.26)
  Bottom Layer w0.152: v1(12.82,22.26) 13.71,21.37 22.85,21.37 23.36,21.88 R3.2
IO9: length 13.5
  Top Layer w0.152: U2.17 15.14,22.1 v1(15.1,22.14)
  Bottom Layer w0.152: R11.2 23.06,23.24 21.96,22.14 v1(15.1,22.14)
IO10: length 13.2
  Top Layer w0.152: U2.18 16.5,18.57 v1(16.5,23.02)
  Bottom Layer w0.152: v1(16.5,23.02) 21.58,23.02 23.15,24.59 R13.2
IO11: length 13.1
  Top Layer w0.152: U2.19 17.77,18.57 v1(17.77,24.04)
  Bottom Layer w0.152: R14.2 22.22,25.95 20.31,24.04 v1(17.77,24.04)
IO12: length 13.8
  Top Layer w0.152: v1(18.91,25.06) 18.95,25.02 U2.20
  Bottom Layer w0.152: R15.2 20.02,27.3 18.91,26.2 v1(18.91,25.06)
IO13: length 25.5
  Top Layer w0.152: v1(34.15,24.68) 34.15,16.67 33.29,15.81 21.05,15.81 20.56,16.29 20.56,18.13 U2.21
  Bottom Layer w0.152: R66.2 v1(34.15,24.68)
IO16: length 19.6
  Top Layer w0.152: v1(13.96,26.07) 10.87,26.07 U2.9
  Bottom Layer w0.152: R47.2 15.28,32.73 13.96,31.41 v1(13.96,26.07)
IO17: length 17.3
  Top Layer w0.152: v1(12.56,24.8) 10.87,24.8 U2.10
  Bottom Layer w0.152: R46.2 16.89,30.02 15.99,29.12 15.99,26.58 14.21,24.8 v1(12.56,24.8)
IO18: length 15.8
  Top Layer w0.152: v1(12.31,23.53) 10.87,23.53 U2.11
  Bottom Layer w0.152: R45.2 19.47,28.66 14.34,23.53 v1(12.31,23.53)
SNA_DVDD_1.8V: length 54.3
  Top Layer w0.254: v1(34.15,30.27) 35.29,30.27 36.06,29.5 36.06,9.31 34.94,8.19 15.71,8.19 14.72,9.18 v1(14.72,15.76)
  Bottom Layer w0.254: CON2.10 v1(34.15,30.27)
  Bottom Layer w0.508: R5.2 v1(14.72,15.76)
SNA_IOVDD_1.8V: length 56.2
  Top Layer w0.254: v1(33.14,29.63) 34.75,29.63 35.7,28.68 35.7,9.46 34.79,8.55 15.87,8.55 15.08,9.33 15.08,15 15.84,15.76 v1(17.64,15.76)
  Bottom Layer w0.254: CON2.11 32.99,29.77 v1(33.14,29.63) ; R9.2 v1(17.64,15.76)
  Bottom Layer w0.508: 15.86,14.5 16.27,14.5 16.75,14.98 16.75,15.73 R9.2
SNR_AVDD_2.8V: length 73.3
  Top Layer w0.254: v1(33.9,34.96) 34.03,35.09 36.16,35.09 36.41,34.84 36.41,9.17 35.08,7.83 15.18,7.83 v1(14.85,8.17)
  Bottom Layer w0.152: 33.52,34.33 32.46,33.27 CON2.4 31.02,33.27 29.71,34.58 28.82,34.58 26.13,37.27 24.52,37.27 ; 24.52,37.27 24.52,37.91 R54.2 ; 24.52,37.27 R55.2
  Bottom Layer w0.254: 33.52,34.33 33.9,34.71 v1(33.9,34.96)
  Bottom Layer w0.508: v1(14.85,8.17) 14.85,12.94 15.15,13.25 16.37,13.25 C9.1 ; U4.2 14.41,14.05 R12.1
$1N2819: length 7.4
  Bottom Layer w0.254: USB1.A5 26.51,4.88 27.17,4.23 31.11,4.23 31.36,4.48 31.36,5.31
$1N2820: length 6.8
  Bottom Layer w0.254: USB1.B5 23.51,4.89 22.85,4.23 19.42,4.23 19.02,4.63 R17.1
$1N2861: length 1.5
  Top Layer w0.152: 9.15,21.09 10.5,21.09 10.6,21
$1N2863: length 1.5
  Top Layer w0.152: 9.14,19.7 10.61,19.7
$1N2883: length 24.1
  Top Layer w0.152: U2.15 12.57,18.45 v1(9.52,18.45)
  Bottom Layer w0.152: R65.2 9.52,38.86 v1(9.52,18.45)

## Copper pours and planes (outline as drawn; the poured copper is in the pictures)
GND on Top Layer: -0.39,58.33 39.36,58.33 39.36,-0.85 -0.39,-0.85
GND on Bottom Layer: -0.14,58.08 38.85,58.08 38.85,-0.22 -0.14,-0.22
VDD3V3 on Bottom Layer: 12.95,17.41 14.42,17.41 14.42,8.22 12.95,8.22
VDD3V3 on Bottom Layer: 22.49,20.03 25.89,20.03 25.89,11.67 22.49,11.67

Small or netless copper shapes (teardrops, artwork), in the pictures only: 7 on Bottom Layer

## Text on the board
Bottom Silkscreen Layer: G | 5V | SCL | SDA
